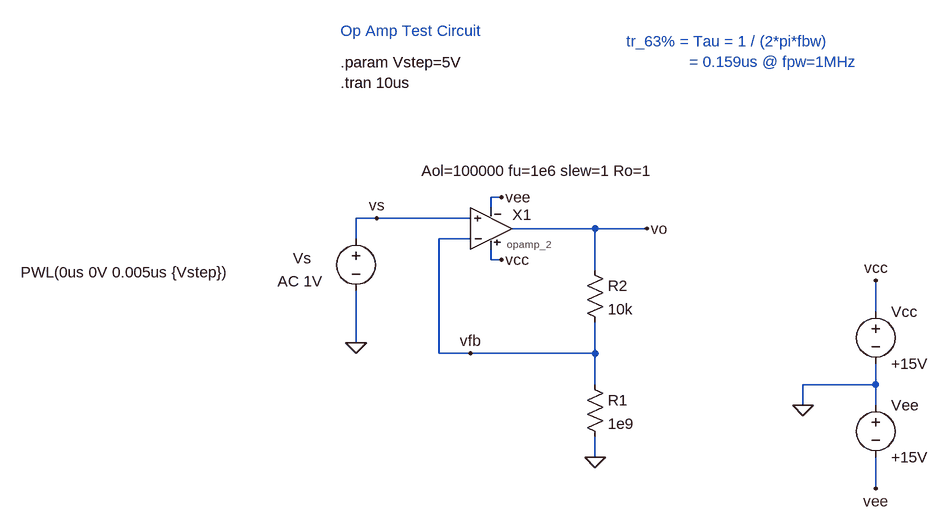
[diagram p0: schematic Test_Circuit_opamp_2.asc]
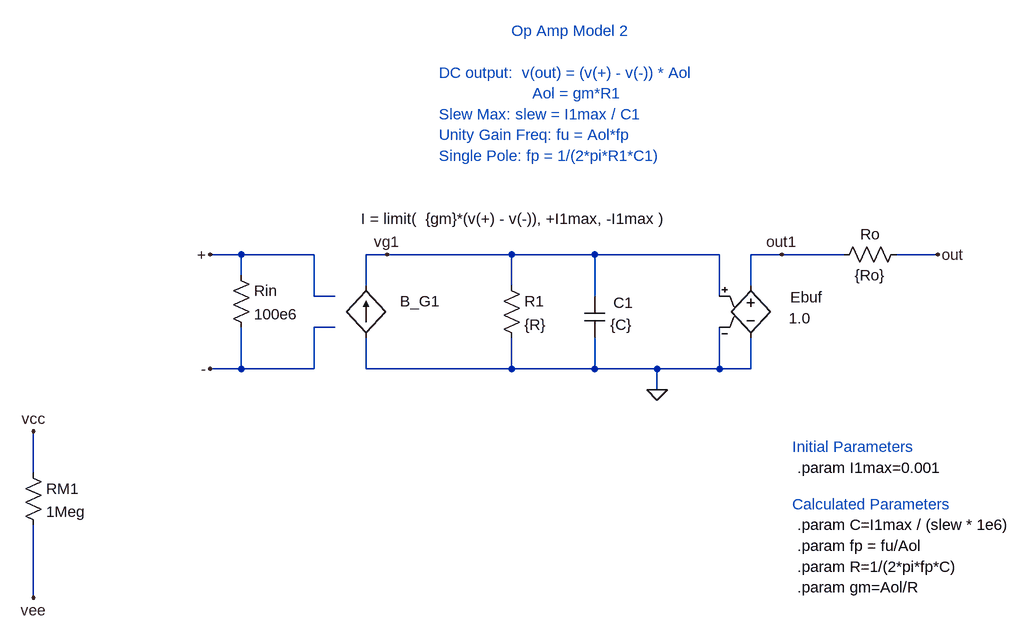
[diagram p1: sub-circuit opamp_2.asc]
Test_Circuit_opamp_2.asc, the LTspice schematic file:
Version 4
SHEET 1 968 680
WIRE -1056 -416 -1072 -416
WIRE -1072 -400 -1072 -416
WIRE -1248 -384 -1280 -384
WIRE -1104 -384 -1248 -384
WIRE -912 -368 -1040 -368
WIRE -832 -368 -912 -368
WIRE -1280 -352 -1280 -384
WIRE -1104 -352 -1152 -352
WIRE -1072 -320 -1072 -336
WIRE -1056 -320 -1072 -320
WIRE -912 -304 -912 -368
WIRE -480 -240 -480 -288
WIRE -1280 -192 -1280 -272
WIRE -1152 -176 -1152 -352
WIRE -1104 -176 -1152 -176
WIRE -912 -176 -912 -224
WIRE -912 -176 -1104 -176
WIRE -912 -128 -912 -176
WIRE -480 -128 -480 -160
WIRE -480 -128 -592 -128
WIRE -592 -96 -592 -128
WIRE -480 -96 -480 -128
WIRE -912 -16 -912 -48
WIRE -480 32 -480 -16
FLAG -592 -96 0
FLAG -480 -288 vcc
FLAG -480 32 vee
FLAG -1280 -192 0
FLAG -1056 -416 vee
FLAG -1056 -320 vcc
FLAG -912 -16 0
FLAG -832 -368 vo
FLAG -1248 -384 vs
FLAG -1104 -176 vfb
SYMBOL res -928 -144 R0
SYMATTR InstName R1
SYMATTR Value 1e9
SYMBOL voltage -480 -256 R0
WINDOW 123 0 0 Left 0
WINDOW 39 0 0 Left 0
SYMATTR InstName Vcc
SYMATTR Value +15V
SYMBOL voltage -480 -112 R0
WINDOW 123 0 0 Left 0
WINDOW 39 0 0 Left 0
SYMATTR InstName Vee
SYMATTR Value +15V
SYMBOL voltage -1280 -368 R0
WINDOW 123 -121 81 Left 2
WINDOW 39 0 0 Left 0
WINDOW 0 -97 46 Left 2
WINDOW 3 -516 67 Left 2
SYMATTR Value2 AC 1V
SYMATTR InstName Vs
SYMATTR Value PWL(0us 0V 0.005us {Vstep})
SYMBOL res -928 -320 R0
SYMATTR InstName R2
SYMATTR Value 10k
SYMBOL opamp_2 -1072 -368 R0
WINDOW 0 33 -21 Left 2
WINDOW 39 -107 -89 Left 2
SYMATTR InstName X1
SYMATTR SpiceLine Aol=100000 fu=1e6 slew=1 Ro=1
TEXT -1304 -672 Left 2 ;Op Amp Test Circuit
TEXT -1304 -624 Left 2 !.param Vstep=5V
TEXT -1304 -592 Left 2 !.tran 10us
TEXT -864 -656 Left 2 ;tr_63% = Tau = 1 / (2*pi*fbw)\n              = 0.159us @ fpw=1MHz

opamp_2.asc, the sub-circuit schematic file:
Version 4
SHEET 1 2028 888
WIRE -432 48 -480 48
WIRE -320 48 -432 48
WIRE -208 48 -240 48
WIRE -16 48 -208 48
WIRE 112 48 -16 48
WIRE 304 48 112 48
WIRE 400 48 352 48
WIRE 496 48 400 48
WIRE 640 48 576 48
WIRE -432 80 -432 48
WIRE -240 96 -240 48
WIRE -16 96 -16 48
WIRE 352 96 352 48
WIRE -320 112 -320 48
WIRE -288 112 -320 112
WIRE 112 112 112 48
WIRE 304 112 304 48
WIRE -288 160 -320 160
WIRE -432 224 -432 160
WIRE -432 224 -480 224
WIRE -320 224 -320 160
WIRE -320 224 -432 224
WIRE -240 224 -240 176
WIRE -16 224 -16 176
WIRE -16 224 -240 224
WIRE 112 224 112 176
WIRE 112 224 -16 224
WIRE 208 224 112 224
WIRE 304 224 304 160
WIRE 304 224 208 224
WIRE 352 224 352 176
WIRE 352 224 304 224
WIRE 208 256 208 224
WIRE -752 384 -752 320
WIRE -752 576 -752 464
FLAG -752 576 vee
FLAG -752 320 vcc
FLAG 400 48 out1
FLAG 640 48 out
FLAG -480 48 +
FLAG -480 224 -
FLAG -208 48 vg1
FLAG 208 256 0
SYMBOL e 352 80 R0
WINDOW 0 61 34 Left 2
WINDOW 3 59 66 Left 2
SYMATTR InstName Ebuf
SYMATTR Value 1.0
SYMBOL res 592 32 R90
WINDOW 0 0 56 VBottom 2
WINDOW 3 32 56 VTop 2
SYMATTR InstName Ro
SYMATTR Value {Ro}
SYMBOL res -32 80 R0
SYMATTR InstName R1
SYMATTR Value {R}
SYMBOL cap 96 112 R0
WINDOW 3 40 44 Left 2
WINDOW 0 45 10 Left 2
SYMATTR Value {C}
SYMATTR InstName C1
SYMBOL res -448 64 R0
SYMATTR InstName Rin
SYMATTR Value 100e6
SYMBOL res -768 368 R0
SYMATTR InstName RM1
SYMATTR Value 1Meg
SYMBOL bi2 -240 96 R0
WINDOW 3 -8 -103 Left 2
WINDOW 0 52 24 Left 2
SYMATTR Value I = limit(  {gm}*(v(+) - v(-)), +I1max, -I1max )
SYMATTR InstName B_G1
TEXT 416 432 Left 2 ;Calculated Parameters
TEXT -16 -296 Left 2 ;Op Amp Model 2
TEXT -128 -232 Left 2 ;DC output:  v(out) = (v(+) - v(-)) * Aol
TEXT -128 -104 Left 2 ;Single Pole: fp = 1/(2*pi*R1*C1)
TEXT -128 -136 Left 2 ;Unity Gain Freq: fu = Aol*fp
TEXT 424 464 Left 2 !.param C=I1max / (slew * 1e6)
TEXT 416 344 Left 2 ;Initial Parameters
TEXT 424 560 Left 2 !.param gm=Aol/R
TEXT 424 496 Left 2 !.param fp = fu/Aol
TEXT 424 376 Left 2 !.param I1max=0.001
TEXT 424 528 Left 2 !.param R=1/(2*pi*fp*C)
TEXT 16 -200 Left 2 ;Aol = gm*R1
TEXT -128 -168 Left 2 ;Slew Max: slew = I1max / C1

The netlist it stands for:
* Test_Circuit_opamp_2.asc
R1 vfb 0 1e9
Vcc vcc 0 +15V
Vee 0 vee +15V
Vs vs 0 PWL(0us 0V 0.005us {Vstep}) AC 1V
R2 vo vfb 10k
XX1 vs vfb vcc vee vo opamp_2 params: Aol=100000 fu=1e6 slew=1 Ro=1

* block symbol definitions
.subckt opamp_2 + - vcc vee out
Ebuf out1 0 vg1 0 1.0
Ro out out1 {Ro}
R1 vg1 0 {R}
C1 vg1 0 {C}
Rin + - 100e6
RM1 vcc vee 1Meg
B_G1 0 vg1 I = limit(  {gm}*(v(+) - v(-)), +I1max, -I1max )
* Calculated Parameters
* Op Amp Model 2
* DC output:  v(out) = (v(+) - v(-)) * Aol
* Single Pole: fp = 1/(2*pi*R1*C1)
* Unity Gain Freq: fu = Aol*fp
.param C=I1max / (slew * 1e6)
* Initial Parameters
.param gm=Aol/R
.param fp = fu/Aol
.param I1max=0.001
.param R=1/(2*pi*fp*C)
* Aol = gm*R1
* Slew Max: slew = I1max / C1
.ends opamp_2

* Op Amp Test Circuit
.param Vstep=5V
.tran 10us
* tr_63% = Tau = 1 / (2*pi*fbw)
*               = 0.159us @ fpw=1MHz
.backanno
.end